# EAGLE design umodular_shiled_amm (EAGLE 7.2.0)
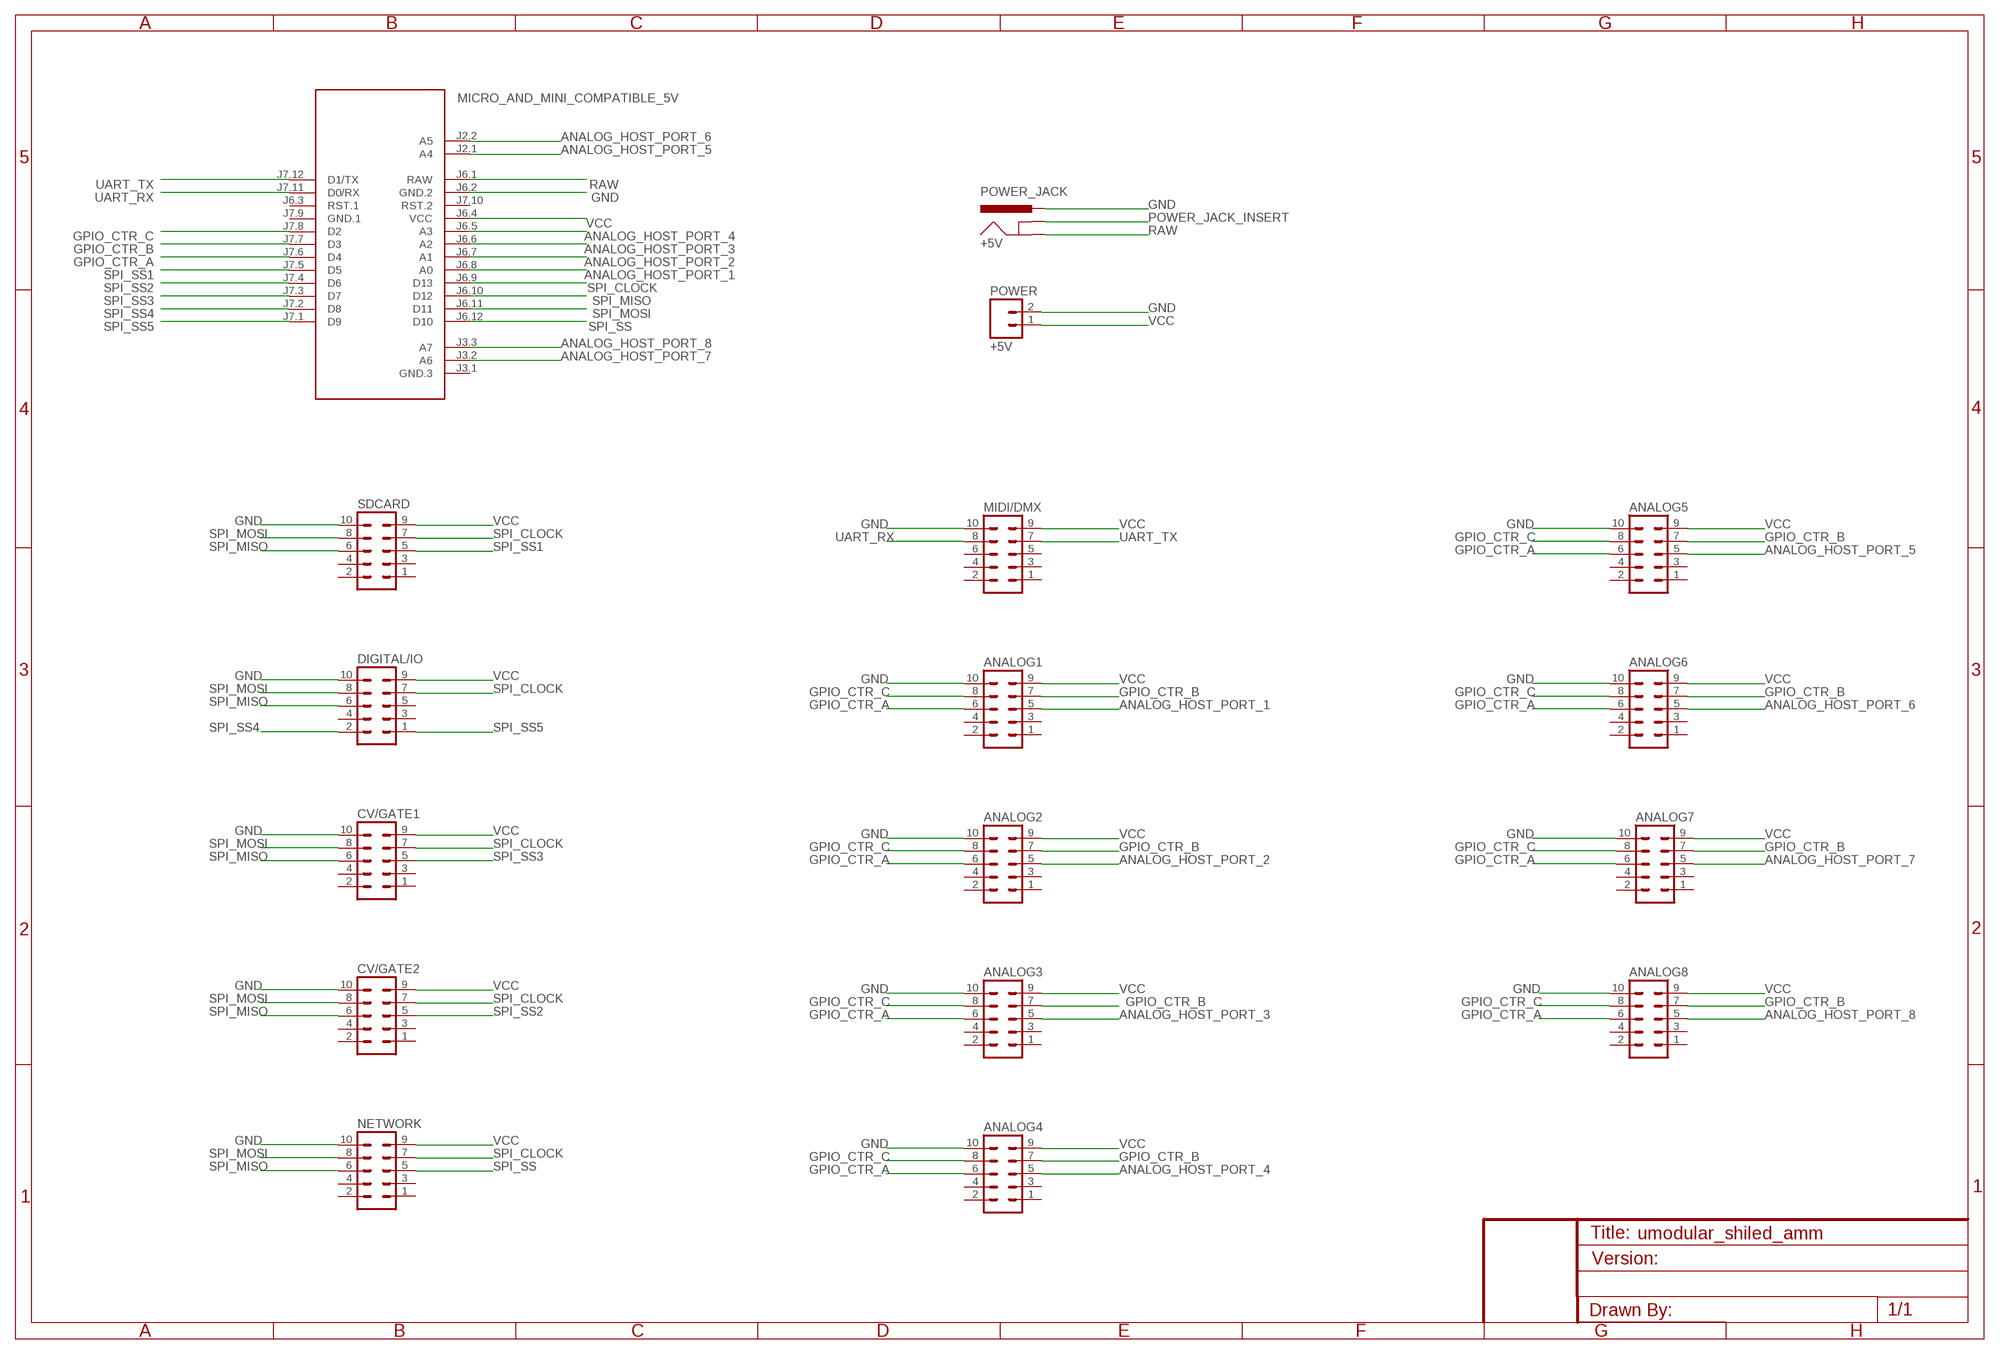
[diagram p0: schematic, sheet 1]

## Parts
+5V  POWER_JACK  POWER_JACKPTH  [POWER_JACK_PTH]
ANALOG1  MA05-2  [MA05-2]
ANALOG2  MA05-2  [MA05-2]
ANALOG3  MA05-2  [MA05-2]
ANALOG4  MA05-2  [MA05-2]
ANALOG5  MA05-2  [MA05-2]
ANALOG6  MA05-2  [MA05-2]
ANALOG7  MA05-2  [MA05-2]
ANALOG8  MA05-2  [MA05-2]
CV/GATE1  MA05-2  [MA05-2]
CV/GATE2  MA05-2  [MA05-2]
DIGITAL/IO  MA05-2  [MA05-2]
MICRO_AND_MINI_COMPATIBLE_5V  ARDUINO-PRO-MINI-3.3V#NP  [ARDUINO-PRO-MINI#NP]
MIDI/DMX  MA05-2  [MA05-2]
NETWORK  MA05-2  [MA05-2]
POWER  +5V  M02LOCK_LONGPADS  [1X02_LOCK_LONGPADS]
SDCARD  MA05-2  [MA05-2]

## Nets
ANALOG_HOST_PORT_1: ANALOG1.5 MICRO_AND_MINI_COMPATIBLE_5V.J6.8(A0)
ANALOG_HOST_PORT_2: ANALOG2.5 MICRO_AND_MINI_COMPATIBLE_5V.J6.7(A1)
ANALOG_HOST_PORT_3: ANALOG3.5 MICRO_AND_MINI_COMPATIBLE_5V.J6.6(A2)
ANALOG_HOST_PORT_4: ANALOG4.5 MICRO_AND_MINI_COMPATIBLE_5V.J6.5(A3)
ANALOG_HOST_PORT_5: ANALOG5.5 MICRO_AND_MINI_COMPATIBLE_5V.J2.1(A4)
ANALOG_HOST_PORT_6: ANALOG6.5 MICRO_AND_MINI_COMPATIBLE_5V.J2.2(A5)
ANALOG_HOST_PORT_7: ANALOG7.5 MICRO_AND_MINI_COMPATIBLE_5V.J3.2(A6)
ANALOG_HOST_PORT_8: ANALOG8.5 MICRO_AND_MINI_COMPATIBLE_5V.J3.3(A7)
GND: +5V.PWR ANALOG1.10 ANALOG2.10 ANALOG3.10 ANALOG4.10 ANALOG5.10 ANALOG6.10 ANALOG7.10 ANALOG8.10 CV/GATE1.10 CV/GATE2.10 DIGITAL/IO.10 MICRO_AND_MINI_COMPATIBLE_5V.J6.2(GND.2) MIDI/DMX.10 NETWORK.10 POWER.2 SDCARD.10
GPIO_CTR_A: ANALOG1.6 ANALOG2.6 ANALOG3.6 ANALOG4.6 ANALOG5.6 ANALOG6.6 ANALOG7.6 ANALOG8.6 MICRO_AND_MINI_COMPATIBLE_5V.J7.6(D4)
GPIO_CTR_B: ANALOG1.7 ANALOG2.7 ANALOG3.7 ANALOG4.7 ANALOG5.7 ANALOG6.7 ANALOG7.7 ANALOG8.7 MICRO_AND_MINI_COMPATIBLE_5V.J7.7(D3)
GPIO_CTR_C: ANALOG1.8 ANALOG2.8 ANALOG3.8 ANALOG4.8 ANALOG5.8 ANALOG6.8 ANALOG7.8 ANALOG8.8 MICRO_AND_MINI_COMPATIBLE_5V.J7.8(D2)
POWER_JACK_INSERT: +5V.GNDBREAK
RAW: +5V.GND MICRO_AND_MINI_COMPATIBLE_5V.J6.1(RAW)
SPI_CLOCK: CV/GATE1.7 CV/GATE2.7 DIGITAL/IO.7 MICRO_AND_MINI_COMPATIBLE_5V.J6.9(D13) NETWORK.7 SDCARD.7
SPI_MISO: CV/GATE1.6 CV/GATE2.6 DIGITAL/IO.6 MICRO_AND_MINI_COMPATIBLE_5V.J6.10(D12) NETWORK.6 SDCARD.6
SPI_MOSI: CV/GATE1.8 CV/GATE2.8 DIGITAL/IO.8 MICRO_AND_MINI_COMPATIBLE_5V.J6.11(D11) NETWORK.8 SDCARD.8
SPI_SS: MICRO_AND_MINI_COMPATIBLE_5V.J6.12(D10) NETWORK.5
SPI_SS1: MICRO_AND_MINI_COMPATIBLE_5V.J7.5(D5) SDCARD.5
SPI_SS2: CV/GATE2.5 MICRO_AND_MINI_COMPATIBLE_5V.J7.4(D6)
SPI_SS3: CV/GATE1.5 MICRO_AND_MINI_COMPATIBLE_5V.J7.3(D7)
SPI_SS4: DIGITAL/IO.2 MICRO_AND_MINI_COMPATIBLE_5V.J7.2(D8)
SPI_SS5: DIGITAL/IO.1 MICRO_AND_MINI_COMPATIBLE_5V.J7.1(D9)
UART_RX: MICRO_AND_MINI_COMPATIBLE_5V.J7.11(D0/RX) MIDI/DMX.8
UART_TX: MICRO_AND_MINI_COMPATIBLE_5V.J7.12(D1/TX) MIDI/DMX.7
VCC: ANALOG1.9 ANALOG2.9 ANALOG3.9 ANALOG4.9 ANALOG5.9 ANALOG6.9 ANALOG7.9 ANALOG8.9 CV/GATE1.9 CV/GATE2.9 DIGITAL/IO.9 MICRO_AND_MINI_COMPATIBLE_5V.J6.4(VCC) MIDI/DMX.9 NETWORK.9 POWER.1 SDCARD.9
Unconnected: ANALOG1.1 ANALOG1.2 ANALOG1.3 ANALOG1.4 ANALOG2.1 ANALOG2.2 ANALOG2.3 ANALOG2.4 ANALOG3.1 ANALOG3.2 ANALOG3.3 ANALOG3.4 ANALOG4.1 ANALOG4.2 ANALOG4.3 ANALOG4.4 ANALOG5.1 ANALOG5.2 ANALOG5.3 ANALOG5.4 ANALOG6.1 ANALOG6.2 ANALOG6.3 ANALOG6.4 ANALOG7.1 ANALOG7.2 ANALOG7.3 ANALOG7.4 ANALOG8.1 ANALOG8.2 ANALOG8.3 ANALOG8.4 CV/GATE1.1 CV/GATE1.2 CV/GATE1.3 CV/GATE1.4 CV/GATE2.1 CV/GATE2.2 CV/GATE2.3 CV/GATE2.4 DIGITAL/IO.3 DIGITAL/IO.4 DIGITAL/IO.5 MICRO_AND_MINI_COMPATIBLE_5V.J3.1(GND.3) MICRO_AND_MINI_COMPATIBLE_5V.J6.3(RST.1) MICRO_AND_MINI_COMPATIBLE_5V.J7.10(RST.2) MIDI/DMX.1 MIDI/DMX.2 MIDI/DMX.3 MIDI/DMX.4 MIDI/DMX.5 MIDI/DMX.6 NETWORK.1 NETWORK.2 NETWORK.3 NETWORK.4 SDCARD.1 SDCARD.2 SDCARD.3 SDCARD.4

## Power pins joined to a net without a drawn wire
GND.1: MICRO_AND_MINI_COMPATIBLE_5V.J7.9(GND.1)

## Library data of the parts
+5V = SparkFun-Connectors:POWER_JACK: Power Jack This is the standard 5.5mm barrel jack for power. The PTH is the most common, proven, reliable, footprint. The Slot footprint only works if the mill layer is transmitted to the PCB fab house so be warned. Spark Fun Electronics SKU : PRT-00119 SMT: CONN-08106 Mating wall wart : TOL-00298 (and others)
ANALOG1-ANALOG8 CV/GATE1 CV/GATE2 DIGITAL/IO MIDI/DMX NETWORK SDCARD = con-lstb:MA05-2: PIN HEADER; OC_FARNELL: unknown; OC_NEWARK: unknown
MICRO_AND_MINI_COMPATIBLE_5V = diy-modules:ARDUINO-PRO-MINI-*#NP: Arduino Pro Mini without programming pads
POWER = SparkFun-Connectors:M02: Standard 2-pin 0.1" header. Use with - straight break away headers ( PRT-00116) - right angle break away headers (PRT-00553) - swiss pins (PRT-00743) - machine pins (PRT-00117) - female headers (PRT-00115) Molex polarized connector foot print use with: PRT-08233 with associated crimp pins and housings. 2.54_SCREWTERM for use with PRT-10571. 3.5mm Screw Terminal footprints for PRT-08084 5mm Screw Terminal footprints for use with PRT-08433

## Net classes
0 default: width 0.254 mm

## Board
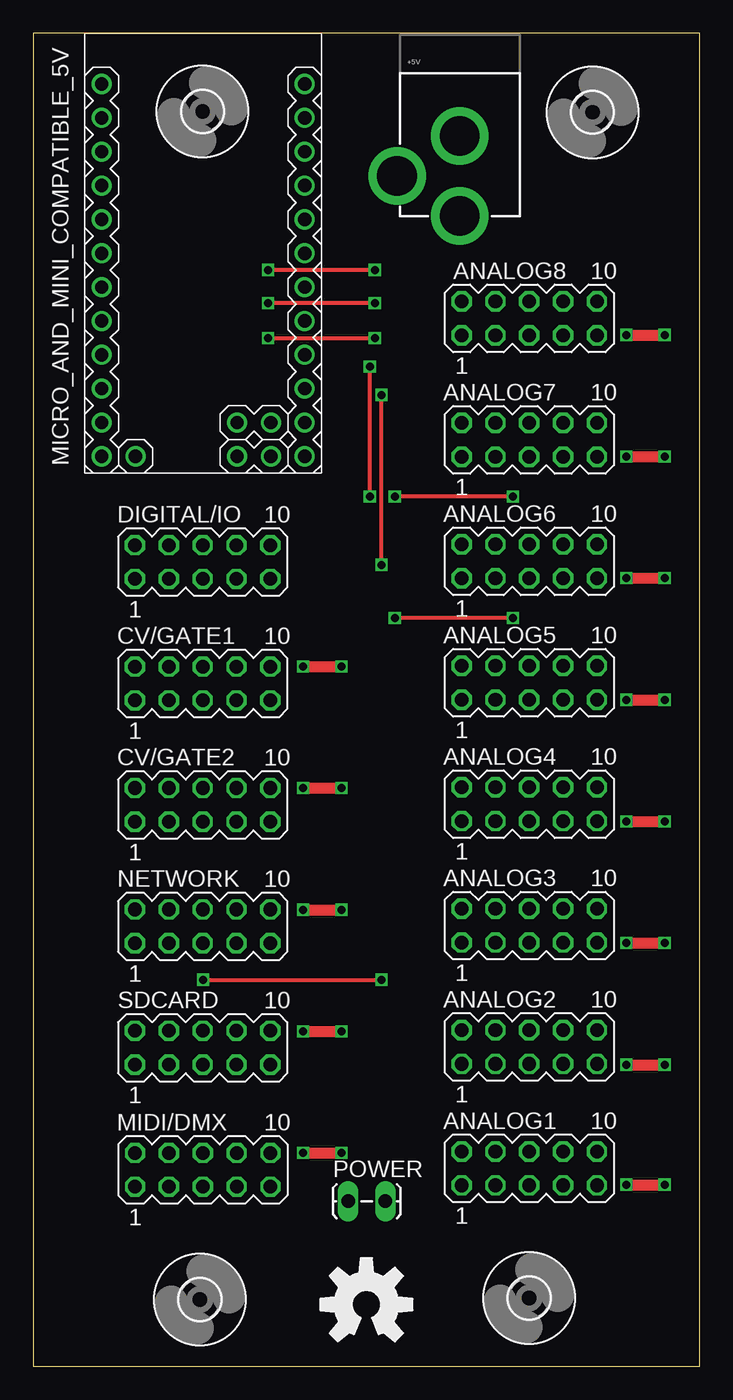
[diagram p1: board, top side]
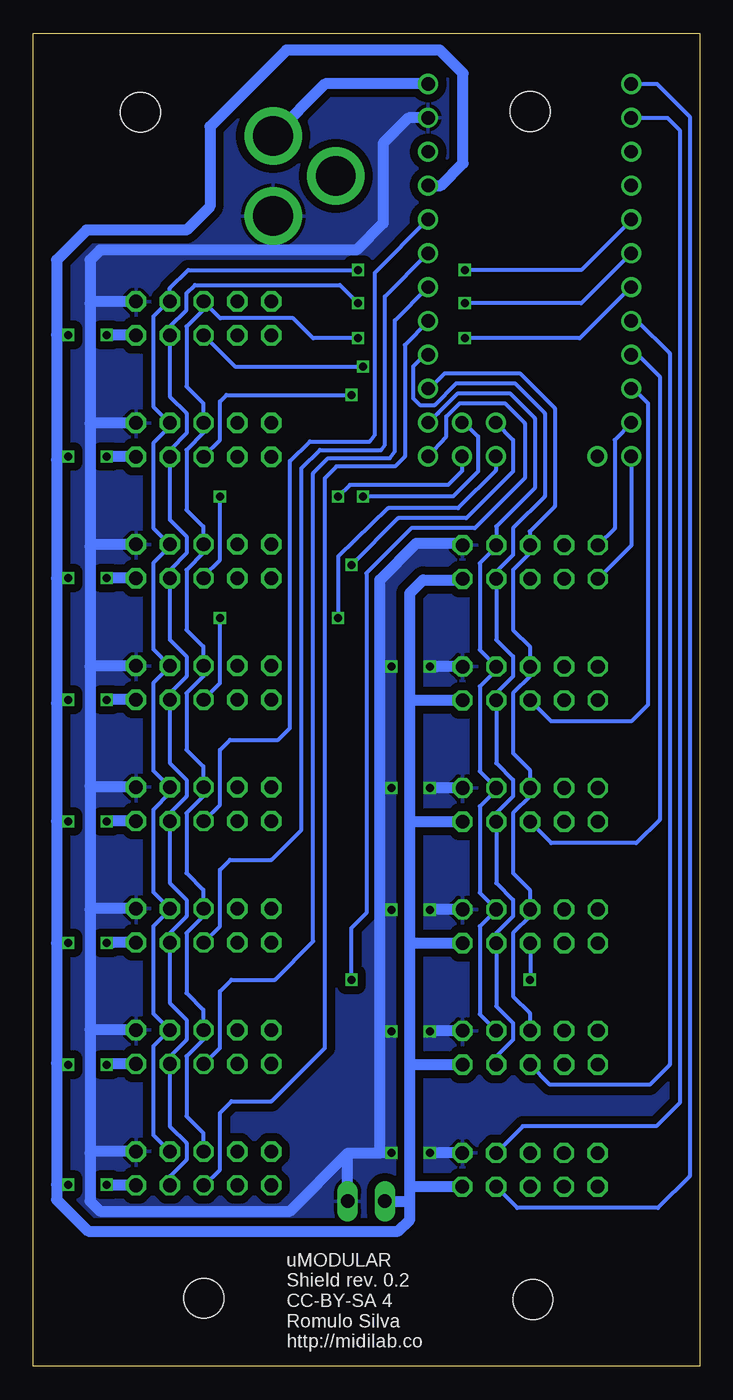
[diagram p2: board, bottom side, seen from below]

Size 50 x 100 mm. Coordinates in mm from the lower left corner, seen from the top.
Outline: 0,0 50,0 50,100 0,100 0,0
Copper layers (1*16): Top 0.035mm / dielectric 1.5mm / Bottom 0.035mm
Design rules "SeeedStudio_2layer_DRU_no_angle_20140221": minimum track width 6mil, minimum drill 12mil, track to track 6mil, track to pad 6mil, pad to pad 6mil, via to via 6mil, smd to smd 0mil, copper to edge 10mil, drill to drill 10mil, minimum pad ring 10mil, minimum via ring 6mil, stop-mask expansion 2mil, vias tented up to drill 100mil, thermal gap 10mil

### Footprints (pad centres in the part's own frame; a part is rotated, then mirrored left to right if it is on the bottom)
POWER_JACK_PTH = drill 2.997 pad 4.318: GND 0,7.7; GNDBREAK 4.7,10.7; PWR 0,13.7
MA05-2 = drill 1.016 octagon: 1 -5.08,-1.27; 2 -5.08,1.27; 3 -2.54,-1.27; 4 -2.54,1.27; 5 0,-1.27; 6 0,1.27; 7 2.54,-1.27; 8 2.54,1.27; 9 5.08,-1.27; 10 5.08,1.27
ARDUINO-PRO-MINI#NP = drill 1: J2.1 15.24,2.54; J2.2 15.24,5.08; J3.1 15.24,-5.08; J3.2 12.7,2.54; J3.3 12.7,5.08; J6.1 -12.7,7.62; J6.2 -10.16,7.62; J6.3 -7.62,7.62; J6.4 -5.08,7.62; J6.5 -2.54,7.62; J6.6 0,7.62; J6.7 2.54,7.62; J6.8 5.08,7.62; J6.9 7.62,7.62; J6.10 10.16,7.62; J6.11 12.7,7.62; J6.12 15.24,7.62; J7.1 15.24,-7.62; J7.2 12.7,-7.62; J7.3 10.16,-7.62; J7.4 7.62,-7.62; J7.5 5.08,-7.62; J7.6 2.54,-7.62; J7.7 0,-7.62; J7.8 -2.54,-7.62; J7.9 -5.08,-7.62; J7.10 -7.62,-7.62; J7.11 -10.16,-7.62; J7.12 -12.7,-7.62
1X02_LOCK_LONGPADS = drill 1.016 long: 1 -0.127,0; 2 2.667,0
3,0 = hole 3: 0,0

### Placement (x,y rotation side)
+5V  32,100 180 top
ANALOG1  37.22,14.84 0 top
ANALOG2  37.22,23.95 0 top
ANALOG3  37.22,33.06 0 top
ANALOG4  37.22,42.17 0 top
ANALOG5  37.22,51.28 0 top
ANALOG6  37.22,60.39 0 top
ANALOG7  37.22,69.5 0 top
ANALOG8  37.22,78.61 0 top
CV/GATE1  12.71,51.22 0 top
CV/GATE2  12.71,42.11 0 top
DIGITAL/IO  12.71,60.33 0 top
MICRO_AND_MINI_COMPATIBLE_5V  12.75,83.5 270 top
MIDI/DMX  12.72,14.73 0 top
NETWORK  12.71,33 0 top
POWER  23.75,12.38 0 top
SDCARD  12.71,23.89 0 top
U$1  [3,0]  12.71,94.13 0 top
U$2  [3,0]  37.2,5.1 0 top
U$3  [3,0]  12.51,5 0 top
U$4  [3,0]  41.96,94.08 0 top
U$5  [OSHW-LOGO-L]  25,4.62 0 top

### Tracks (layer width: path | path; a pad name or v marks a point on that pad's centre or on a via)
ANALOG_HOST_PORT_1
  Bottom 0.305: ANALOG1.5 37.18,13.57 36,14.75 36,19 35.12,19.88 32.12,19.88 28.12,23.88 28.12,66.62 27.25,67.5 22.88,67.5 22.12,68.25 22.12,76.62 20.37,78.38 MICRO_AND_MINI_COMPATIBLE_5V.J6.8
ANALOG_HOST_PORT_2
  Bottom 0.305: ANALOG2.5 37.2,22.68 36,23.88 36,28.12 35.12,29 31.88,29 29,31.88 29,67 27.88,68.12 23.25,68.12 22.88,68.62 22.88,78.45 MICRO_AND_MINI_COMPATIBLE_5V.J6.7
ANALOG_HOST_PORT_3
  Bottom 0.305: ANALOG3.5 36,33 36,37.25 35.25,38 32.12,38 29.88,40.25 29.88,67.38 28.5,68.75 23.88,68.75 23.62,69.12 23.62,80.25 MICRO_AND_MINI_COMPATIBLE_5V.J6.6
ANALOG_HOST_PORT_4
  Bottom 0.305: ANALOG4.5 36,42.12 36,46.25 35.25,47 31.62,47 30.75,47.88 30.75,67.91 30.71,67.91 29.25,69.38 24.75,69.38 24.38,69.88 24.38,82.03 MICRO_AND_MINI_COMPATIBLE_5V.J6.5
ANALOG_HOST_PORT_5  (via drill 0.6)
  Top 0.305: v36,56.12 v27.12,56.12
  Bottom 0.305: ANALOG5.5 37.22,50.03 36,51.25 v36,56.12 | MICRO_AND_MINI_COMPATIBLE_5V.J2.1 15.29,67.21 18.12,64.38 23.38,64.38 27.12,60.75 v27.12,56.12
ANALOG_HOST_PORT_6  (via drill 0.6)
  Top 0.305: v36,65.25 v27.12,65.25
  Bottom 0.305: ANALOG6.5 37.22,59.28 36,60.5 v36,65.25 | MICRO_AND_MINI_COMPATIBLE_5V.J2.2 17.83,67.17 18.88,66.12 26.25,66.12 v27.12,65.25
ANALOG_HOST_PORT_7  (via drill 0.6)
  Top 0.305: v26.12,60.12 v26.12,72.88
  Bottom 0.305: ANALOG7.5 37.22,68.28 36,69.5 36,72.38 35.5,72.88 v26.12,72.88 | MICRO_AND_MINI_COMPATIBLE_5V.J3.2 14,69.5 14,67.12 17.5,63.62 22.62,63.62 v26.12,60.12
ANALOG_HOST_PORT_8  (via drill 0.6)
  Top 0.305: v25.25,65.25 v25.25,75
  Bottom 0.305: ANALOG8.5 37.16,77.34 37.16,77.28 34.88,75 v25.25,75 | MICRO_AND_MINI_COMPATIBLE_5V.J3.3 17.68,70.8 16.62,69.75 16.62,67.12 18.5,65.25 v25.25,65.25
GND  (via drill 0.6)
  Top 0.813: v20.25,52.5 v23.12,52.5 | v20.25,43.38 v23.12,43.38 | v20.25,34.25 v23.12,34.25 | v20.25,25.12 v23.12,25.12 | v20.25,16 v23.12,16
  Bottom 0.813: MICRO_AND_MINI_COMPATIBLE_5V.J6.2 21.84,93.66 23.75,91.75 23.75,85.75 25.75,83.75 32,83.75 | +5V.PWR 32,83.75 | 32,83.75 45,83.75 45.75,83 45.75,79.75 | 45.75,79.75 45.75,70.75 | 45.75,70.75 45.75,61.5 | 45.75,61.5 45.75,52.5 | 45.75,52.5 45.75,43.5 | 45.75,43.5 45.75,34.25 | 45.75,34.25 45.75,25.25 | 45.75,25.25 45.75,16 | ANALOG8.10 45.62,79.88 45.75,79.75 | ANALOG7.10 45.73,70.77 45.75,70.75 | ANALOG6.10 45.59,61.66 45.75,61.5 | ANALOG5.10 45.7,52.55 45.75,52.5 | ANALOG4.10 45.69,43.44 45.75,43.5 | ANALOG3.10 45.67,34.33 45.75,34.25 | ANALOG2.10 45.72,25.22 45.75,25.25 | ANALOG1.10 45.64,16.11 45.75,16 | 24,16.12 24,16 v23.12,16 | 24,16.12 24,25.12 | 24,25.12 24,34.25 | 24,34.25 24,43.5 | 24,43.5 24,52.5 | 24,52.5 24,59 21.25,61.75 17.94,61.75 DIGITAL/IO.10 | CV/GATE1.10 19.74,52.49 v20.25,52.5 | v23.12,52.5 24,52.5 | CV/GATE2.10 19.88,43.38 v20.25,43.38 | v23.12,43.38 23.88,43.38 24,43.5 | NETWORK.10 19.77,34.27 v20.25,34.25 | v23.12,34.25 24,34.25 | SDCARD.10 19.66,25.16 v20.25,25.12 | v23.12,25.12 24,25.12 | MIDI/DMX.10 v20.25,16 | 24,16.12 24.12,16 26.38,16 26.42,15.96 | POWER.2 26.42,15.96 | 45.75,16 45.75,12.38 45,11.62 30.75,11.62 26.42,15.96
  pour Bottom (isolate 0.61): 0,100 50,100 50,92 50,-0.5 0,-0.5
GPIO_CTR_A  (via drill 0.6)
  Top 0.305: v17.62,77.12 v25.62,77.12
  Bottom 0.305: ANALOG8.6 37.22,79.28 38.5,78 38.5,73.5 37.25,72.25 37.25,70.8 ANALOG7.6 37.22,70.03 38.5,68.75 38.5,64.25 37.25,63 37.25,61.69 ANALOG6.6 37.22,61.03 38.5,59.75 38.5,55.25 37.25,54 37.25,52.58 ANALOG5.6 37.22,51.78 38.5,50.5 38.5,46.25 37.25,45 37.25,43.47 ANALOG4.6 37.22,42.78 38.5,41.5 38.5,37 37.25,35.75 37.25,34.36 ANALOG3.6 37.22,33.78 38.5,32.5 38.5,28 37.25,26.75 37.25,25.25 ANALOG2.6 37.22,24.53 38.5,23.25 38.5,18.75 37.25,17.5 37.25,16.14 ANALOG1.6 | ANALOG8.6 37.22,80.03 | MICRO_AND_MINI_COMPATIBLE_5V.J7.6 5.17,80.96 9,77.12 v17.62,77.12 | v25.62,77.12 29,77.12 30.5,78.62 35.97,78.62 ANALOG8.6
GPIO_CTR_B  (via drill 0.6)
  Top 0.305: v25.62,79.75 v17.62,79.75
  Bottom 0.305: ANALOG1.7 39.75,14.25 38.5,15.5 38.5,16.75 39.76,18.01 ANALOG2.7 39.75,23.25 38.5,24.5 38.5,26 39.76,27.26 ANALOG3.7 39.75,32.5 38.5,33.75 38.5,35 39.76,36.26 ANALOG4.7 39.75,41.5 38.5,42.75 38.5,44 39.76,45.26 ANALOG5.7 39.75,50.5 38.5,51.75 38.5,53.25 39.76,54.51 ANALOG6.7 39.75,59.75 38.5,61 38.5,62.25 39.76,63.51 ANALOG7.7 39.75,68.75 38.5,70 38.5,71.5 39.76,72.76 ANALOG8.7 39.76,77.99 38.5,79.25 38.5,80.5 37.88,81.12 27,81.12 v25.62,79.75 | MICRO_AND_MINI_COMPATIBLE_5V.J7.7 8.88,79.75 v17.62,79.75 17.75,79.75
GPIO_CTR_C  (via drill 0.6)
  Top 0.305: v25.62,82.25 v17.62,82.25
  Bottom 0.305: ANALOG1.8 41,17.35 41,24 39.78,25.22 ANALOG2.8 41,26.46 41,33 39.76,34.24 ANALOG3.8 41,35.57 41,41.75 39.76,42.99 ANALOG4.8 41,44.68 41,51.25 39.76,52.49 ANALOG5.8 41,53.79 41,60.25 39.76,61.49 ANALOG6.8 41,62.9 41,69.25 39.76,70.49 ANALOG7.8 41,72.01 41,78.75 40.12,79.63 40.01,79.63 ANALOG8.8 39.76,80.86 38.38,82.25 v25.62,82.25 | MICRO_AND_MINI_COMPATIBLE_5V.J7.8 5.13,86 8.88,82.25 v17.62,82.25
RAW
  Bottom 0.813: MICRO_AND_MINI_COMPATIBLE_5V.J6.1 28.1,96.2 +5V.GND
SPI_CLOCK
  Bottom 0.305: SDCARD.7 15.25,23.25 14,24.5 14,25.75 15.25,27 NETWORK.7 15.25,32.5 14,33.75 14,35 15.25,36.25 CV/GATE2.7 15.25,41.5 14,42.75 14,44 15.25,45.25 CV/GATE1.7 15.25,50.5 14,51.75 14,53.25 15.25,54.5 DIGITAL/IO.7 15.25,59.62 14,60.88 14,62.88 11.62,65.25 11.62,71.5 13.88,73.75 18.25,73.75 19.88,72.12 21,72.12 21.5,72.62 21.5,75 20.62,75.88 MICRO_AND_MINI_COMPATIBLE_5V.J6.9
SPI_MISO
  Bottom 0.305: SDCARD.6 12.75,25.2 12.75,26.5 14,27.75 14,32.5 12.71,33.79 NETWORK.6 12.75,34.31 12.75,35.75 14,37 14,41.5 12.71,42.79 CV/GATE2.6 12.75,43.42 12.75,44.75 14,46 14,50.5 12.71,51.79 CV/GATE1.6 12.75,52.53 12.75,54 14,55.25 14,59.75 12.71,61.04 DIGITAL/IO.6 12.75,61.64 12.75,62.62 10.88,64.5 10.88,71.88 13.5,74.5 19.12,74.5 20.29,73.34 MICRO_AND_MINI_COMPATIBLE_5V.J6.10
SPI_MOSI
  Bottom 0.305: SDCARD.8 16.5,26.41 16.5,33 15.25,34.25 NETWORK.8 16.5,35.52 16.5,42 15.25,43.25 CV/GATE2.8 16.5,44.63 16.5,51 15.25,52.25 CV/GATE1.8 16.5,53.74 16.5,60.25 15.25,61.5 DIGITAL/IO.8 15.25,63 12.38,65.88 12.38,71.12 14.25,73 18.12,73 19.62,71.5 MICRO_AND_MINI_COMPATIBLE_5V.J6.11
SPI_SS  (via drill 0.6)
  Top 0.305: v12.75,29 v26.12,29
  Bottom 0.305: MICRO_AND_MINI_COMPATIBLE_5V.J6.12 19,69.75 19,71.25 18,72.25 14.62,72.25 13.12,70.75 13.12,66.62 16.88,62.88 21.62,62.88 25,59.5 25,34 26.12,32.88 v26.12,29 | NETWORK.5 12.71,29.04 v12.75,29
SPI_SS1
  Bottom 0.305: MICRO_AND_MINI_COMPATIBLE_5V.J7.5 4.67,78.42 2.25,76 2.25,22.62 3.75,21.12 11.21,21.12 SDCARD.5
SPI_SS2
  Bottom 0.305: MICRO_AND_MINI_COMPATIBLE_5V.J7.4 4.63,75.88 3,74.25 3,41 4.75,39.25 11.12,39.25 CV/GATE2.5
SPI_SS3
  Bottom 0.305: MICRO_AND_MINI_COMPATIBLE_5V.J7.3 4.96,73.34 3.88,72.25 3.88,49.62 5.12,48.38 11.13,48.38 CV/GATE1.5
SPI_SS4
  Bottom 0.305: MICRO_AND_MINI_COMPATIBLE_5V.J7.2 5.13,70.75 6.38,69.5 6.38,62.85 DIGITAL/IO.2
SPI_SS5
  Bottom 0.305: MICRO_AND_MINI_COMPATIBLE_5V.J7.1 5.13,61.56 DIGITAL/IO.1
UART_RX
  Bottom 0.305: MICRO_AND_MINI_COMPATIBLE_5V.J7.11 2.41,93.66 1.5,92.75 1.5,19.75 3.25,18 13.26,18 MIDI/DMX.8
UART_TX
  Bottom 0.305: MICRO_AND_MINI_COMPATIBLE_5V.J7.12 3.2,96.2 0.75,93.75 0.75,14.25 3.12,11.88 13.68,11.88 MIDI/DMX.7
VCC  (via drill 0.6)
  Top 0.813: v44.5,68.25 v47.38,68.25 | v44.5,59.12 v47.38,59.12 | v44.5,50 v47.38,50 | v44.5,40.88 v47.38,40.88 | v44.5,31.75 v47.38,31.75 | v44.5,22.62 v47.38,22.62 | v44.5,13.62 v47.38,13.62 | v44.5,77.38 v47.38,77.38
  Bottom 0.813: MICRO_AND_MINI_COMPATIBLE_5V.J6.4 19.42,88.58 17.75,90.25 17.75,97 19.5,98.75 31,98.75 36.75,93 36.75,87 38.5,85.25 46,85.25 48.25,83 48.25,77.38 | 48.25,77.38 48.25,68 | 48.25,68 48.25,59.12 | 48.25,59.12 48.25,49.75 | 48.25,49.75 48.25,40.88 | 48.25,40.88 48.25,31.75 | 48.25,31.75 48.25,22.75 | 48.25,22.75 48.25,13.62 | ANALOG7.9 44.23,68.23 v44.5,68.25 | v47.38,68.25 48,68.25 48.25,68 | ANALOG6.9 44.12,59.12 v44.5,59.12 | v47.38,59.12 48.25,59.12 | ANALOG5.9 44.24,50.01 v44.5,50 | v47.38,50 48,50 48.25,49.75 | ANALOG4.9 44.15,40.9 v44.5,40.88 | v47.38,40.88 48.25,40.88 | ANALOG3.9 44.04,31.79 v44.5,31.75 | v47.38,31.75 48.25,31.75 | ANALOG2.9 44.18,22.68 v44.5,22.62 | v47.38,22.62 48,22.62 48.25,22.75 | ANALOG1.9 44.07,13.57 v44.5,13.62 | v47.38,13.62 48.25,13.62 | ANALOG8.9 44.09,77.34 v44.5,77.38 | v47.38,77.38 48.25,77.38 | 21.75,22.75 21.75,13.5 21.62,13.5 | 21.75,22.75 21.75,31.5 | 21.75,31.5 21.75,40.75 | 21.75,40.75 21.75,50 | 21.75,50 21.75,58 20.75,59 17.85,59 DIGITAL/IO.9 | 21.62,13.5 17.84,13.5 MIDI/DMX.9 | SDCARD.9 21.62,22.62 21.75,22.75 | NETWORK.9 21.52,31.73 21.75,31.5 | CV/GATE2.9 21.66,40.84 21.75,40.75 | CV/GATE1.9 21.7,49.95 21.75,50 | 21.62,13.5 21.75,13.38 21.75,12.38 | 48.25,13.62 48.25,12.5 45.88,10.12 22.62,10.12 21.75,11 21.75,12.38 | POWER.1 21.75,12.38

### Text on the board
bNames: uMODULAR / Shield rev. 0.2 / CC-BY-SA 4 / Romulo Silva / http://midilab.co